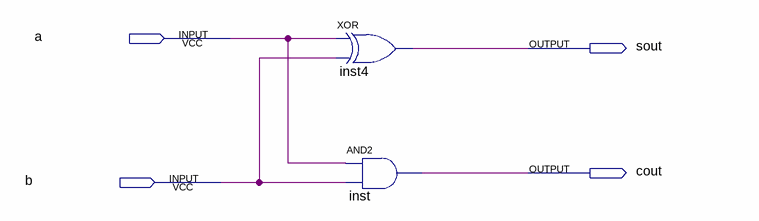
[diagram p0: schematic sheet]
// Quartus schematic Half_adder1.bdf as structural Verilog: 2 symbols, 4 pins
module Half_adder1 (
  input  a,
  input  b,
  output sout,
  output cout
);

  xor inst4 (sout, a, b);
  and inst (cout, a, b);
endmodule
